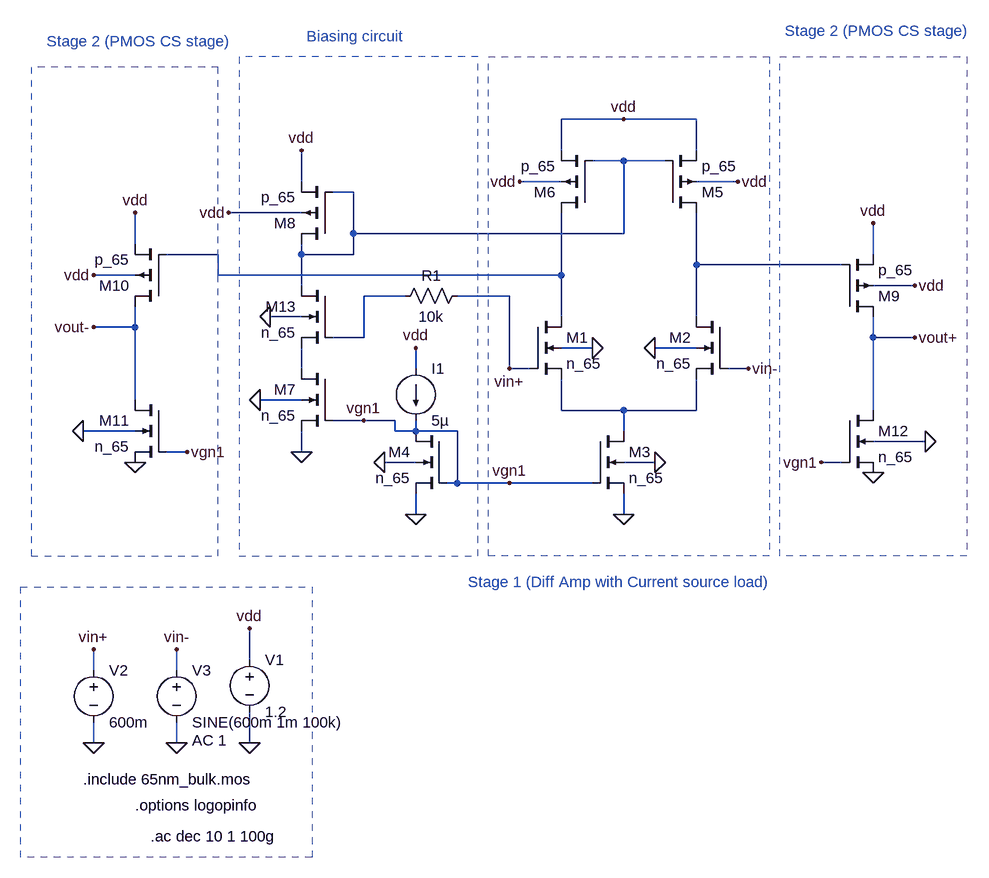
[diagram p0: schematic two_stg_diff_amp.asc]
two_stg_diff_amp.asc, the LTspice schematic file:
Version 4.1
SHEET 1 1128 1028
WIRE 336 -112 240 -112
WIRE 448 -112 336 -112
WIRE 240 -64 240 -112
WIRE 448 -64 448 -112
WIRE 336 -48 288 -48
WIRE 400 -48 336 -48
WIRE -160 -16 -160 -64
WIRE 240 -16 176 -16
WIRE 512 -16 448 -16
WIRE -80 0 -112 0
WIRE -160 32 -272 32
WIRE -80 64 -80 0
WIRE 336 64 336 -48
WIRE 336 64 -80 64
WIRE -416 80 -416 32
WIRE -288 96 -368 96
WIRE -160 96 -160 80
WIRE -80 96 -80 64
WIRE -80 96 -160 96
WIRE 720 96 720 48
WIRE 448 112 448 32
WIRE 672 112 448 112
WIRE -416 128 -480 128
WIRE -288 128 -288 96
WIRE 240 128 240 32
WIRE 240 128 -288 128
WIRE -160 144 -160 96
WIRE 784 144 720 144
WIRE 0 160 -64 160
WIRE 160 160 80 160
WIRE -160 192 -208 192
WIRE 240 192 240 128
WIRE 448 192 448 112
WIRE -416 208 -416 176
WIRE -416 208 -480 208
WIRE -64 224 -64 160
WIRE -64 224 -112 224
WIRE 720 224 720 192
WIRE 784 224 720 224
WIRE 288 240 240 240
WIRE 448 240 384 240
WIRE -160 272 -160 240
WIRE 16 272 16 240
WIRE 160 272 160 160
WIRE 192 272 160 272
WIRE 528 272 496 272
WIRE -416 320 -416 208
WIRE -160 320 -224 320
WIRE 240 336 240 288
WIRE 336 336 240 336
WIRE 448 336 448 288
WIRE 448 336 336 336
WIRE 720 336 720 224
WIRE -64 352 -112 352
WIRE -16 352 -64 352
WIRE -416 368 -496 368
WIRE -16 368 -16 352
WIRE 16 368 16 352
WIRE 16 368 -16 368
WIRE 80 368 16 368
WIRE 336 368 336 336
WIRE 800 384 720 384
WIRE -336 400 -368 400
WIRE -160 400 -160 368
WIRE 16 416 -32 416
WIRE 384 416 336 416
WIRE 672 416 640 416
WIRE 80 448 80 368
WIRE 80 448 64 448
WIRE 160 448 80 448
WIRE 288 448 160 448
WIRE 16 496 16 464
WIRE 336 496 336 464
WIRE -240 720 -240 672
WIRE -480 736 -480 704
WIRE -352 736 -352 704
WIRE -480 848 -480 816
WIRE -352 848 -352 816
WIRE -240 848 -240 800
FLAG 288 240 0
FLAG 384 240 0
FLAG 384 416 0
FLAG 336 496 0
FLAG -32 416 0
FLAG 16 496 0
FLAG 16 240 vdd
FLAG 160 272 vin+
FLAG 528 272 vin-
FLAG 512 -16 vdd
FLAG 176 -16 vdd
FLAG 336 -112 vdd
FLAG -160 400 0
FLAG -272 32 vdd
FLAG -160 -64 vdd
FLAG -224 320 0
FLAG -240 672 vdd
FLAG -240 848 0
FLAG -480 848 0
FLAG -352 848 0
FLAG -352 704 vin-
FLAG -480 704 vin+
FLAG -64 352 vgn1
FLAG 160 448 vgn1
FLAG 784 144 vdd
FLAG 720 432 0
FLAG 800 384 0
FLAG 640 416 vgn1
FLAG 784 224 vout+
FLAG -208 192 0
FLAG 720 48 vdd
FLAG -480 128 vdd
FLAG -416 416 0
FLAG -496 368 0
FLAG -336 400 vgn1
FLAG -480 208 vout-
FLAG -416 32 vdd
SYMBOL nmos4 192 192 R0
SYMATTR InstName M1
SYMATTR Value n_65
SYMATTR Value2 l=180n w=10u
SYMBOL nmos4 496 192 M0
SYMATTR InstName M2
SYMATTR Value n_65
SYMATTR Value2 l=180n w=10u
SYMBOL nmos4 288 368 R0
SYMATTR InstName M3
SYMATTR Value n_65
SYMATTR Value2 l=300n w=10u
SYMBOL nmos4 64 368 M0
SYMATTR InstName M4
SYMATTR Value n_65
SYMATTR Value2 l=300n w=10u
SYMBOL current 16 272 R0
WINDOW 123 0 0 Left 0
WINDOW 39 0 0 Left 0
SYMATTR InstName I1
SYMATTR Value 5µ
SYMBOL pmos4 400 32 M180
SYMATTR InstName M5
SYMATTR Value p_65
SYMATTR Value2 l=200n w=5u
SYMBOL pmos4 288 32 R180
SYMATTR InstName M6
SYMATTR Value p_65
SYMATTR Value2 l=200n w=5u
SYMBOL nmos4 -112 272 M0
SYMATTR InstName M7
SYMATTR Value n_65
SYMATTR Value2 l=300n w=5u
SYMBOL pmos4 -112 80 R180
SYMATTR InstName M8
SYMATTR Value p_65
SYMATTR Value2 l=200n w=5u
SYMBOL voltage -240 704 R0
WINDOW 123 0 0 Left 0
WINDOW 39 0 0 Left 0
SYMATTR InstName V1
SYMATTR Value 1.2
SYMBOL voltage -480 720 R0
WINDOW 123 0 0 Left 0
WINDOW 39 0 0 Left 0
SYMATTR InstName V2
SYMATTR Value 600m
SYMBOL voltage -352 720 R0
WINDOW 123 24 124 Left 2
WINDOW 39 0 0 Left 0
SYMATTR Value2 AC 1
SYMATTR InstName V3
SYMATTR Value SINE(600m 1m 100k)
SYMBOL pmos4 672 192 M180
SYMATTR InstName M9
SYMATTR Value p_65
SYMATTR Value2 l=100n w=5u
SYMBOL nmos4 672 336 R0
SYMATTR InstName M12
SYMATTR Value n_65
SYMATTR Value2 l=300n w=30u
SYMBOL nmos4 -112 144 M0
SYMATTR InstName M13
SYMATTR Value n_65
SYMATTR Value2 l=180n w=10u
SYMBOL res 96 144 R90
WINDOW 0 0 56 VBottom 2
WINDOW 3 32 56 VTop 2
SYMATTR InstName R1
SYMATTR Value 10k
SYMBOL pmos4 -368 176 R180
SYMATTR InstName M10
SYMATTR Value p_65
SYMATTR Value2 l=100n w=5u
SYMBOL nmos4 -368 320 M0
SYMATTR InstName M11
SYMATTR Value n_65
SYMATTR Value2 l=300n w=30u
TEXT -496 904 Left 2 !.include 65nm_bulk.mos
TEXT -416 944 Left 2 !.options logopinfo
TEXT 96 600 Left 2 ;Stage 1 (Diff Amp with Current source load)
TEXT 584 -248 Left 2 ;Stage 2 (PMOS CS stage)
TEXT -552 -232 Left 2 ;Stage 2 (PMOS CS stage)
TEXT -152 -240 Left 2 ;Biasing circuit
TEXT -392 992 Left 2 !.ac dec 10 1 100g
RECTANGLE Normal 560 560 128 -208 2
RECTANGLE Normal 864 560 576 -208 2
RECTANGLE Normal -144 1024 -592 608 2
RECTANGLE Normal -256 560 112 -208 2
RECTANGLE Normal -576 560 -288 -192 2

The netlist it stands for:
* two_stg_diff_amp.asc
M1 N002 vin+ N006 0 n_65 l=180n w=10u
M2 N003 vin- N006 0 n_65 l=180n w=10u
M3 N006 vgn1 0 0 n_65 l=300n w=10u
M4 vgn1 vgn1 0 0 n_65 l=300n w=10u
I1 vdd vgn1 5µ
M5 N003 N001 vdd vdd p_65 l=200n w=5u
M6 N002 N001 vdd vdd p_65 l=200n w=5u
M7 N005 vgn1 0 0 n_65 l=300n w=5u
M8 N001 N001 vdd vdd p_65 l=200n w=5u
V1 vdd 0 1.2
V2 vin+ 0 600m
V3 vin- 0 SINE(600m 1m 100k) AC 1
M9 vout+ N003 vdd vdd p_65 l=100n w=5u
M12 vout+ vgn1 0 0 n_65 l=300n w=30u
M13 N001 N004 N005 0 n_65 l=180n w=10u
R1 vin+ N004 10k
M10 vout- N002 vdd vdd p_65 l=100n w=5u
M11 vout- vgn1 0 0 n_65 l=300n w=30u
.model NMOS NMOS
.model PMOS PMOS
.lib standard.mos
.include 65nm_bulk.mos
.options logopinfo
* Stage 1 (Diff Amp with Current source load)
* Stage 2 (PMOS CS stage)
* Stage 2 (PMOS CS stage)
* Biasing circuit
.ac dec 10 1 100g
.backanno
.end